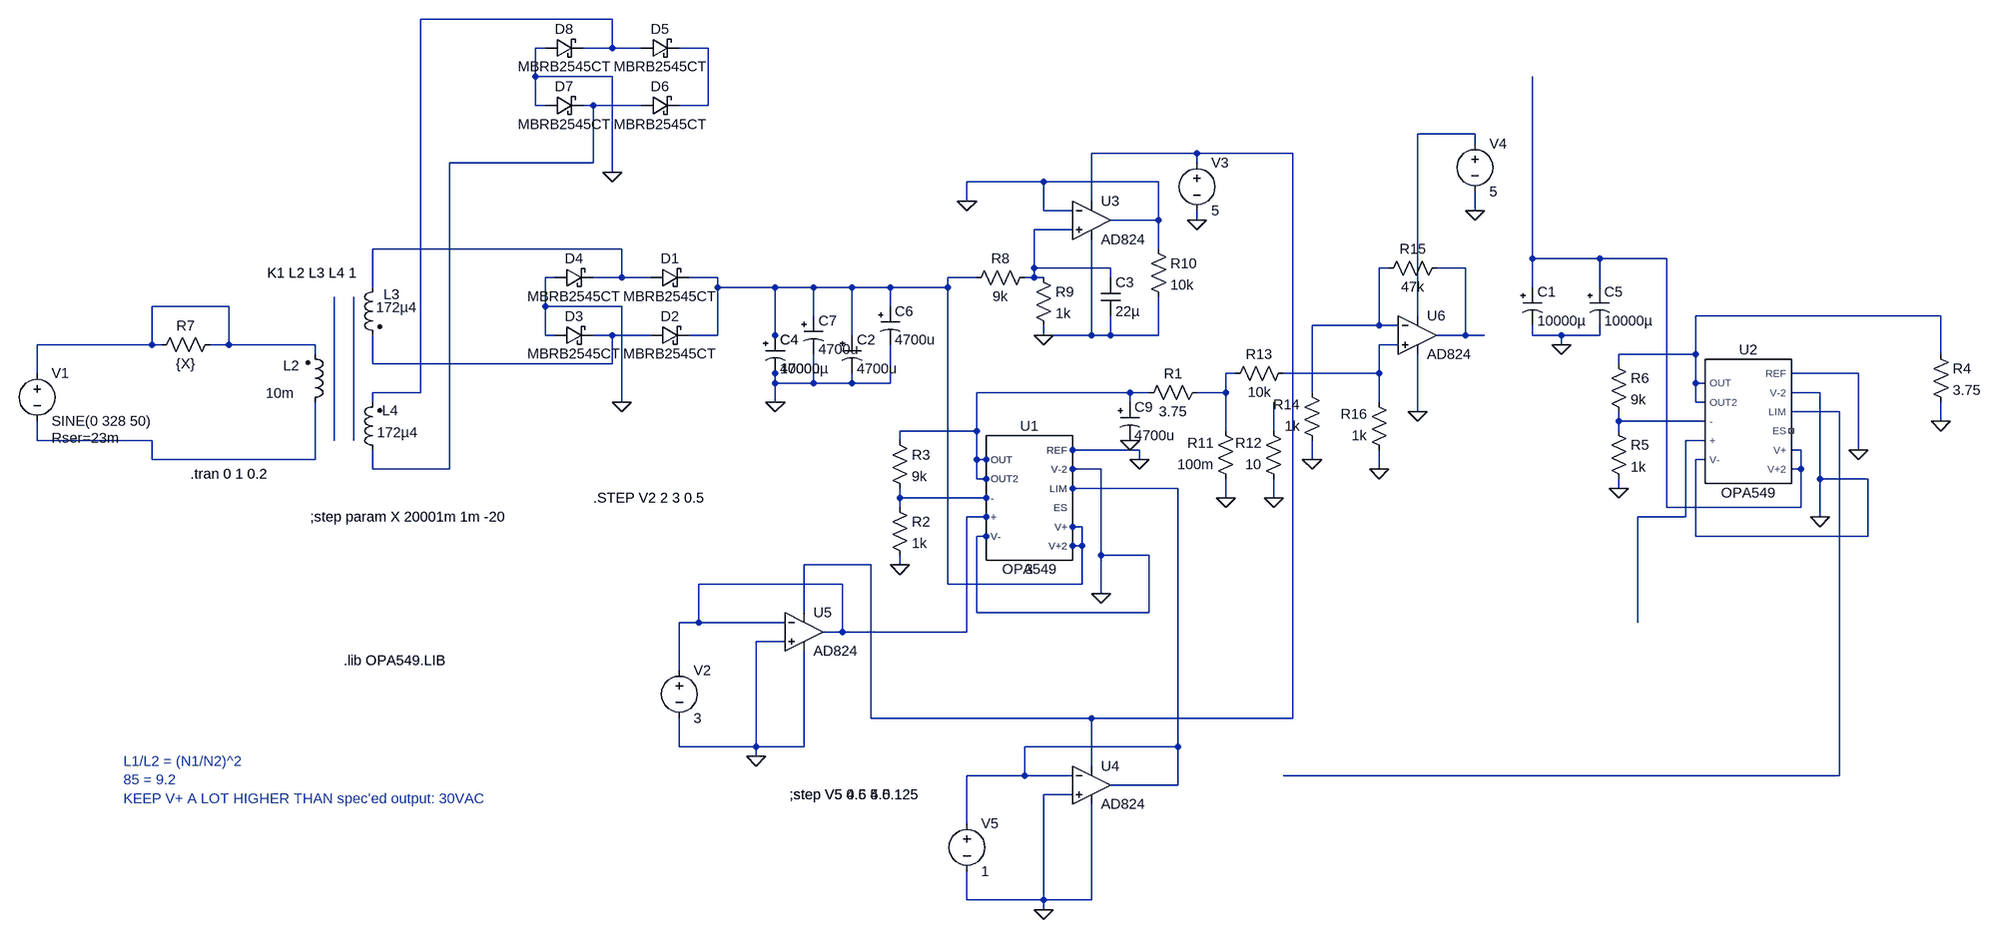
[diagram p0: schematic trafo-calcs.asc]
trafo-calcs.asc, the LTspice schematic file:
Version 4
<<<<<<< Updated upstream
SHEET 1 3600 1232
=======
SHEET 1 4744 1140
>>>>>>> Stashed changes
WIRE 1008 -384 688 -384
WIRE 896 -336 880 -336
WIRE 1008 -336 1008 -384
WIRE 1008 -336 960 -336
WIRE 1056 -336 1008 -336
WIRE 1168 -336 1120 -336
WIRE 880 -288 880 -336
WIRE 1008 -288 880 -288
WIRE 880 -240 880 -288
WIRE 896 -240 880 -240
WIRE 976 -240 960 -240
WIRE 1056 -240 976 -240
WIRE 1168 -240 1168 -336
WIRE 1168 -240 1120 -240
WIRE 2448 -192 2352 -192
WIRE 2448 -176 2448 -192
WIRE 1984 -160 1808 -160
WIRE 2144 -160 1984 -160
WIRE 976 -144 976 -240
WIRE 976 -144 736 -144
WIRE 1984 -144 1984 -160
WIRE 1008 -128 1008 -288
WIRE 1728 -112 1600 -112
WIRE 1920 -112 1728 -112
WIRE 1600 -80 1600 -112
WIRE 1808 -80 1808 -160
WIRE 1728 -64 1728 -112
WIRE 1776 -64 1728 -64
WIRE 2448 -64 2448 -96
WIRE 1920 -48 1920 -112
WIRE 1920 -48 1840 -48
WIRE 1984 -48 1984 -64
WIRE 1776 -32 1712 -32
WIRE 1024 0 608 0
WIRE 1920 0 1920 -48
WIRE 2544 16 2544 -288
WIRE 2656 16 2544 16
WIRE 2768 16 2656 16
WIRE 1712 32 1712 -32
WIRE 1840 32 1712 32
WIRE 2304 32 2288 32
WIRE 2432 32 2384 32
WIRE 912 48 896 48
WIRE 1024 48 1024 0
WIRE 1024 48 976 48
WIRE 1072 48 1024 48
WIRE 1184 48 1136 48
WIRE 1616 48 1568 48
WIRE 1712 48 1712 32
WIRE 1712 48 1696 48
WIRE 1728 48 1712 48
WIRE 1840 48 1840 32
WIRE 608 64 608 0
WIRE 1184 64 1184 48
WIRE 1280 64 1184 64
WIRE 1344 64 1280 64
WIRE 1408 64 1344 64
WIRE 1472 64 1408 64
WIRE 1568 64 1568 48
WIRE 1568 64 1472 64
WIRE 2544 64 2544 16
WIRE 2656 64 2656 16
WIRE 368 96 240 96
WIRE 896 96 896 48
WIRE 1024 96 896 96
WIRE 1472 96 1472 64
WIRE 1344 112 1344 64
WIRE 2352 112 2352 -192
WIRE 3264 112 2816 112
WIRE 2288 128 2288 32
WIRE 2288 128 2176 128
WIRE 2320 128 2288 128
WIRE 896 144 896 96
WIRE 912 144 896 144
WIRE 1008 144 976 144
WIRE 1072 144 1008 144
WIRE 1184 144 1184 64
WIRE 1184 144 1136 144
WIRE 1280 144 1280 64
WIRE 1408 144 1408 64
WIRE 1728 144 1728 128
WIRE 1808 144 1808 -16
WIRE 1808 144 1728 144
WIRE 1840 144 1840 112
WIRE 1840 144 1808 144
WIRE 1920 144 1920 80
WIRE 1920 144 1840 144
WIRE 2432 144 2432 32
WIRE 2432 144 2384 144
WIRE 2464 144 2432 144
WIRE 2544 144 2544 128
WIRE 2592 144 2544 144
WIRE 2656 144 2656 128
WIRE 2656 144 2592 144
WIRE 240 160 240 96
WIRE 240 160 48 160
WIRE 256 160 240 160
WIRE 368 160 368 96
WIRE 368 160 336 160
WIRE 512 160 368 160
WIRE 2320 160 2288 160
WIRE 2592 160 2592 144
WIRE 512 176 512 160
WIRE 2816 176 2816 112
WIRE 2816 176 2688 176
WIRE 3264 176 3264 112
WIRE 608 192 608 144
WIRE 1008 192 1008 144
WIRE 1008 192 608 192
WIRE 2688 192 2688 176
WIRE 48 208 48 160
WIRE 2048 208 2032 208
WIRE 2288 208 2288 160
WIRE 2288 208 2128 208
WIRE 3088 208 2976 208
WIRE 1280 224 1280 208
WIRE 1344 224 1344 176
WIRE 1344 224 1280 224
WIRE 1408 224 1408 208
WIRE 1408 224 1344 224
WIRE 1472 224 1472 160
WIRE 1472 224 1408 224
WIRE 2816 224 2816 176
WIRE 2832 224 2816 224
WIRE 688 240 688 -384
WIRE 688 240 608 240
WIRE 1872 240 1616 240
WIRE 1904 240 1872 240
WIRE 2032 240 2032 208
WIRE 2032 240 1984 240
WIRE 2176 240 2176 128
WIRE 3024 240 2976 240
WIRE 608 256 608 240
WIRE 1024 256 1024 96
WIRE 1280 256 1280 224
WIRE 1872 256 1872 240
WIRE 2288 256 2288 208
WIRE 2816 256 2816 224
WIRE 2832 256 2816 256
WIRE 2352 272 2352 176
WIRE 3056 272 2976 272
WIRE 2688 288 2688 272
WIRE 2832 288 2688 288
WIRE 3264 288 3264 256
WIRE 1616 304 1616 240
WIRE 1616 304 1488 304
WIRE 2032 304 2032 240
WIRE 2112 304 2112 256
WIRE 2688 304 2688 288
WIRE 48 320 48 288
WIRE 240 320 48 320
WIRE 544 320 544 80
WIRE 576 320 576 80
WIRE 1488 320 1488 304
WIRE 2832 320 2800 320
WIRE 1888 336 1776 336
WIRE 2992 336 2976 336
WIRE 3088 336 3088 208
WIRE 240 352 240 320
WIRE 512 352 512 256
WIRE 512 352 240 352
WIRE 1616 352 1616 304
WIRE 1632 352 1616 352
WIRE 1888 352 1888 336
WIRE 2176 352 2176 320
WIRE 2832 352 2816 352
WIRE 608 368 608 336
WIRE 736 368 736 -144
WIRE 736 368 608 368
WIRE 1824 368 1776 368
WIRE 2288 368 2288 336
WIRE 2992 368 2992 336
WIRE 2992 368 2976 368
WIRE 1616 384 1616 352
WIRE 1632 384 1616 384
WIRE 3024 384 3024 240
WIRE 3104 384 3024 384
WIRE 1952 400 1776 400
WIRE 2688 400 2688 384
WIRE 1488 416 1488 400
WIRE 1632 416 1488 416
WIRE 2032 416 2032 384
WIRE 2112 416 2112 384
WIRE 1488 432 1488 416
WIRE 2768 432 2768 16
WIRE 2992 432 2992 368
WIRE 2992 432 2768 432
WIRE 1632 448 1600 448
WIRE 2800 448 2800 320
WIRE 2800 448 2720 448
WIRE 3024 448 3024 384
WIRE 1792 464 1776 464
WIRE 1632 480 1616 480
WIRE 2816 480 2816 352
WIRE 3104 480 3104 384
WIRE 3104 480 2816 480
WIRE 1792 496 1792 464
WIRE 1792 496 1776 496
WIRE 1824 512 1824 368
WIRE 1904 512 1824 512
WIRE 1440 528 1328 528
WIRE 1488 528 1488 512
WIRE 1392 560 1152 560
WIRE 1568 560 1568 64
WIRE 1792 560 1792 496
WIRE 1792 560 1568 560
WIRE 1824 576 1824 512
WIRE 1328 608 1328 528
WIRE 1616 608 1616 480
WIRE 1904 608 1904 512
WIRE 1904 608 1616 608
WIRE 1152 624 1152 560
WIRE 1152 624 1120 624
WIRE 1296 624 1152 624
WIRE 2720 624 2720 448
WIRE 1392 640 1392 560
WIRE 1392 640 1360 640
WIRE 1600 640 1600 448
WIRE 1600 640 1392 640
WIRE 1296 656 1248 656
WIRE 1120 704 1120 624
WIRE 1440 784 1440 528
WIRE 1808 784 1440 784
WIRE 2144 784 2144 -160
WIRE 2144 784 1808 784
WIRE 1120 832 1120 784
WIRE 1248 832 1248 656
WIRE 1248 832 1120 832
WIRE 1328 832 1328 672
WIRE 1328 832 1248 832
WIRE 1952 832 1952 400
WIRE 1952 832 1696 832
WIRE 1248 848 1248 832
WIRE 1808 864 1808 784
WIRE 1696 880 1696 832
WIRE 1696 880 1600 880
WIRE 1776 880 1696 880
WIRE 3056 880 3056 272
WIRE 3056 880 2128 880
WIRE 1952 896 1952 832
WIRE 1952 896 1840 896
WIRE 1776 912 1728 912
WIRE 1600 960 1600 880
WIRE 1600 1088 1600 1040
WIRE 1728 1088 1728 912
WIRE 1728 1088 1600 1088
WIRE 1808 1088 1808 928
WIRE 1808 1088 1728 1088
WIRE 1728 1104 1728 1088
FLAG 1024 256 0
FLAG 1280 256 0
FLAG 2032 416 0
FLAG 1824 576 0
FLAG 1488 528 0
FLAG 1888 352 0
FLAG 3264 288 0
FLAG 3024 448 0
FLAG 2688 400 0
FLAG 3088 336 0
FLAG 2592 160 0
FLAG 1008 -128 0
FLAG 1728 144 0
FLAG 1984 -48 0
FLAG 1600 -80 0
FLAG 1728 1104 0
FLAG 1248 848 0
FLAG 2352 272 0
FLAG 2448 -64 0
FLAG 2288 368 0
FLAG 2176 352 0
FLAG 2112 416 0
FLAG 1872 320 0
SYMBOL voltage 48 192 R0
WINDOW 123 0 0 Left 0
WINDOW 39 24 124 Left 2
SYMATTR SpiceLine Rser=23m
SYMATTR InstName V1
SYMATTR Value SINE(0 328 50)
SYMBOL ind2 496 272 M180
WINDOW 0 -37 77 Left 2
WINDOW 3 -66 31 Left 2
SYMATTR InstName L2
SYMATTR Value 10m
SYMATTR Type ind
SYMBOL ind2 624 48 M0
WINDOW 0 -29 28 Left 2
WINDOW 3 -57 50 Left 2
SYMATTR InstName L3
SYMATTR Value 172µ4
SYMATTR Type ind
SYMBOL ind2 624 352 R180
WINDOW 0 -27 82 Left 2
WINDOW 3 -59 45 Left 2
SYMATTR InstName L4
SYMATTR Value 172µ4
SYMATTR Type ind
SYMBOL res 2000 224 R90
WINDOW 0 0 56 VBottom 2
WINDOW 3 32 56 VTop 2
SYMATTR InstName R1
<<<<<<< Updated upstream
SYMATTR Value 3.75
SYMBOL OPA549 1696 416 R0
=======
SYMATTR Value 3
SYMBOL AutoGenerated\\OPA549 1696 416 R0
>>>>>>> Stashed changes
SYMATTR InstName U1
SYMBOL res 1472 416 R0
SYMATTR InstName R2
SYMATTR Value 1k
SYMBOL res 1472 304 R0
SYMATTR InstName R3
SYMATTR Value 9k
SYMBOL voltage 1120 688 R0
WINDOW 123 0 0 Left 0
WINDOW 39 0 0 Left 0
SYMATTR InstName V2
SYMATTR Value 3
SYMBOL res 3248 160 R0
SYMATTR InstName R4
SYMATTR Value 3.75
SYMBOL OPA549 2896 288 R0
SYMATTR InstName U2
SYMBOL res 2672 288 R0
SYMATTR InstName R5
SYMATTR Value 1k
SYMBOL res 2672 176 R0
SYMATTR InstName R6
SYMATTR Value 9k
<<<<<<< Updated upstream
SYMBOL polcap 1264 144 R0
WINDOW 3 24 56 Left 2
SYMATTR Value 10000µ
SYMATTR InstName C4
SYMATTR SpiceLine V=35 Rser=0.033 Lser=0
SYMATTR Description Capacitor
SYMATTR Type cap
=======
>>>>>>> Stashed changes
SYMBOL polcap 2640 64 R0
WINDOW 3 24 56 Left 2
SYMATTR Value 10000µ
SYMATTR InstName C5
SYMATTR SpiceLine V=35 Rser=0.033 Lser=0
SYMATTR Description Capacitor
SYMATTR Type cap
SYMBOL polcap 2528 64 R0
WINDOW 3 24 56 Left 2
SYMATTR Value 10000µ
SYMATTR InstName C1
SYMATTR SpiceLine V=35 Rser=0.033 Lser=0
SYMATTR Description Capacitor
SYMATTR Type cap
SYMBOL polcap 1392 144 R0
WINDOW 3 24 56 Left 2
<<<<<<< Updated upstream
SYMATTR Value 10000µ
=======
SYMATTR Value 4700u
>>>>>>> Stashed changes
SYMATTR InstName C2
SYMATTR SpiceLine V=35 Rser=0.033 Lser=0
SYMATTR Description Capacitor
SYMATTR Type cap
SYMBOL schottky 1072 64 R270
WINDOW 0 32 32 VTop 2
WINDOW 3 0 32 VBottom 2
SYMATTR InstName D1
SYMATTR Value MBRB2545CT
SYMATTR Description Diode
SYMATTR Type diode
SYMBOL schottky 1072 160 R270
WINDOW 0 32 32 VTop 2
WINDOW 3 0 32 VBottom 2
SYMATTR InstName D2
SYMATTR Value MBRB2545CT
SYMATTR Description Diode
SYMATTR Type diode
SYMBOL schottky 912 160 R270
WINDOW 0 32 32 VTop 2
WINDOW 3 0 32 VBottom 2
SYMATTR InstName D3
SYMATTR Value MBRB2545CT
SYMATTR Description Diode
SYMATTR Type diode
SYMBOL schottky 912 64 R270
WINDOW 0 32 32 VTop 2
WINDOW 3 0 32 VBottom 2
SYMATTR InstName D4
SYMATTR Value MBRB2545CT
SYMATTR Description Diode
SYMATTR Type diode
SYMBOL res 352 144 R90
WINDOW 0 0 56 VBottom 2
WINDOW 3 32 56 VTop 2
SYMATTR InstName R7
SYMATTR Value {X}
SYMBOL schottky 1056 -320 R270
WINDOW 0 32 32 VTop 2
WINDOW 3 0 32 VBottom 2
SYMATTR InstName D5
SYMATTR Value MBRB2545CT
SYMATTR Description Diode
SYMATTR Type diode
SYMBOL schottky 1056 -224 R270
WINDOW 0 32 32 VTop 2
WINDOW 3 0 32 VBottom 2
SYMATTR InstName D6
SYMATTR Value MBRB2545CT
SYMATTR Description Diode
SYMATTR Type diode
SYMBOL schottky 896 -224 R270
WINDOW 0 32 32 VTop 2
WINDOW 3 0 32 VBottom 2
SYMATTR InstName D7
SYMATTR Value MBRB2545CT
SYMATTR Description Diode
SYMATTR Type diode
SYMBOL schottky 896 -320 R270
WINDOW 0 32 32 VTop 2
WINDOW 3 0 32 VBottom 2
SYMATTR InstName D8
SYMATTR Value MBRB2545CT
SYMATTR Description Diode
SYMATTR Type diode
SYMBOL Opamps\\AD824 1808 -112 R0
SYMATTR InstName U3
SYMBOL res 1712 32 R90
WINDOW 0 0 56 VBottom 2
WINDOW 3 32 56 VTop 2
SYMATTR InstName R8
SYMATTR Value 9k
SYMBOL res 1712 32 R0
SYMATTR InstName R9
SYMATTR Value 1k
SYMBOL voltage 1984 -160 R0
WINDOW 123 0 0 Left 0
WINDOW 39 0 0 Left 0
SYMATTR InstName V3
SYMATTR Value 5
SYMBOL res 1904 -16 R0
SYMATTR InstName R10
SYMATTR Value 10k
SYMBOL cap 1824 48 R0
SYMATTR InstName C3
SYMATTR Value 22µ
SYMBOL Opamps\\AD824 1808 832 R0
SYMATTR InstName U4
SYMBOL voltage 1600 944 R0
WINDOW 123 0 0 Left 0
WINDOW 39 0 0 Left 0
SYMATTR InstName V5
SYMATTR Value 1
SYMBOL Opamps\\AD824 1328 576 R0
SYMATTR InstName U5
SYMBOL res 2048 400 R180
WINDOW 0 36 76 Left 2
WINDOW 3 36 40 Left 2
SYMATTR InstName R11
SYMATTR Value 100m
SYMBOL Opamps\\AD824 2352 80 R0
SYMATTR InstName U6
SYMBOL res 2144 192 R90
WINDOW 0 0 56 VBottom 2
WINDOW 3 32 56 VTop 2
SYMATTR InstName R13
SYMATTR Value 10k
SYMBOL res 2400 16 R90
WINDOW 0 0 56 VBottom 2
WINDOW 3 32 56 VTop 2
SYMATTR InstName R15
SYMATTR Value 47k
SYMBOL voltage 2448 -192 R0
WINDOW 123 0 0 Left 0
WINDOW 39 0 0 Left 0
SYMATTR InstName V4
SYMATTR Value 5
SYMBOL res 2304 352 R180
WINDOW 0 36 76 Left 2
WINDOW 3 36 40 Left 2
SYMATTR InstName R16
SYMATTR Value 1k
SYMBOL res 2192 336 R180
WINDOW 0 36 76 Left 2
WINDOW 3 36 40 Left 2
SYMATTR InstName R14
SYMATTR Value 1k
SYMBOL res 2128 400 R180
WINDOW 0 36 76 Left 2
WINDOW 3 36 40 Left 2
SYMATTR InstName R12
SYMATTR Value 10
SYMBOL polcap 1456 96 R0
WINDOW 3 24 56 Left 2
SYMATTR Value 4700u
SYMATTR InstName C6
SYMATTR SpiceLine V=35 Rser=0.033 Lser=0
SYMATTR Description Capacitor
SYMATTR Type cap
SYMBOL polcap 1328 112 R0
WINDOW 3 24 56 Left 2
SYMATTR Value 4700u
SYMATTR InstName C7
SYMATTR SpiceLine V=35 Rser=0.033 Lser=0
SYMATTR Description Capacitor
SYMATTR Type cap
SYMBOL polcap 1264 144 R0
WINDOW 3 24 56 Left 2
SYMATTR Value 4700u
SYMATTR InstName C4
SYMATTR SpiceLine V=35 Rser=0.033 Lser=0
SYMATTR Description Capacitor
SYMATTR Type cap
SYMBOL polcap 1856 256 R0
WINDOW 3 24 56 Left 2
SYMATTR Value 4700u
SYMATTR InstName C9
SYMATTR SpiceLine V=35 Rser=0.033 Lser=0
SYMATTR Description Capacitor
SYMATTR Type cap
TEXT 304 376 Left 2 !.tran 0 1 0.2
TEXT 432 40 Left 2 !K1 L2 L3 L4 1
TEXT 192 856 Left 2 ;L1/L2 = (N1/N2)^2\n85 = 9.2\nKEEP V+ A LOT HIGHER THAN spec'ed output: 30VAC
TEXT 976 416 Left 2 !.STEP V2 2 3 0.5
TEXT 504 448 Left 2 !;step param X 20001m 1m -20
<<<<<<< Updated upstream
TEXT 1304 912 Left 2 !;step V5 0.5 4.5 1
TEXT 560 688 Left 2 !.lib OPA549.LIB
=======
TEXT 1304 912 Left 2 !;step V5 4.6 5 0.125
>>>>>>> Stashed changes

The netlist it stands for:
* trafo-calcs.asc
V1 N012 N021 SINE(0 328 50) Rser=23m
L2 N021 N012 10m
L3 N007 N014 172µ4
L4 N003 N001 172µ4
R1 N016 N017 3.75
X? N017 N017 N026 N027 0 0 0 N025 P001 N011 N011 3  ; pins OUT OUT2 - + V- REF V-2 LIM ES V+ V+2
XU1 N017 N017 N026 N027 0 0 0 N025 P001 N011 N011 OPA549  ; pins OUT OUT2 - + V- REF V-2 LIM ES V+ V+2
R2 N026 0 1k
R3 N017 N026 9k
V2 N027 0 3
R4 N013 0 3.75
XU2 N013 N013 N019 N024 0 0 0 N018 NC_01 N008 N008 OPA549  ; pins OUT OUT2 - + V- REF V-2 LIM ES V+ V+2
R5 N019 0 1k
R6 N013 N019 9k
C4 N011 0 10000µ V=35 Rser=0.033 Lser=0
C5 N008 0 10000µ V=35 Rser=0.033 Lser=0
C1 N008 0 10000µ V=35 Rser=0.033 Lser=0
C2 N011 0 4700u V=35 Rser=0.033 Lser=0
D1 N007 N011 MBRB2545CT
D2 N014 N011 MBRB2545CT
D3 0 N014 MBRB2545CT
D4 0 N007 MBRB2545CT
R7 N012 N012 {X}
D5 N001 N002 MBRB2545CT
D6 N003 N002 MBRB2545CT
D7 0 N003 MBRB2545CT
D8 0 N001 MBRB2545CT
XU3 N006 0 N005 0 0 AD824  ; pins In+ In- V+ V- OUT
R8 N006 N011 9k
R9 N006 0 1k
V3 N005 0 5
R10 0 0 10k
C3 N006 0 22µ
XU4 0 N025 N005 0 N025 AD824  ; pins In+ In- V+ V- OUT
V5 N025 0 1
XU5 0 N027 N005 0 N027 AD824  ; pins In+ In- V+ V- OUT
R11 0 N016 100m
XU6 N015 N009 N004 0 N010 AD824  ; pins In+ In- V+ V- OUT
R13 N015 N016 10k
R15 N010 N009 47k
V4 N004 0 5
R16 0 N015 1k
R14 0 N009 1k
R12 0 N020 10
C6 N011 0 4700u V=35 Rser=0.033 Lser=0
C7 N011 0 4700u V=35 Rser=0.033 Lser=0
C4 N011 0 4700u V=35 Rser=0.033 Lser=0
C9 N017 0 4700u V=35 Rser=0.033 Lser=0
.model D D
.lib standard.dio
.tran 0 1 0.2
K1 L2 L3 L4 1
* L1/L2 = (N1/N2)^2
* 85 = 9.2
* KEEP V+ A LOT HIGHER THAN spec'ed output: 30VAC
.STEP V2 2 3 0.5
;step param X 20001m 1m -20
;step V5 0.5 4.5 1
.lib OPA549.LIB
;step V5 4.6 5 0.125
.lib OPA549.LIB
.backanno
.end